# Altium schematic sheet SD.schdoc: TEBF0808 - SD
size A4; DocumentNumber: TEBF0808; Revision: 04; SheetNumber: 24; SheetTotal: 36; Date: 2016-09-29; CompanyName: Trenz Electronic GmbH; Organization: Trenz Electronic GmbH
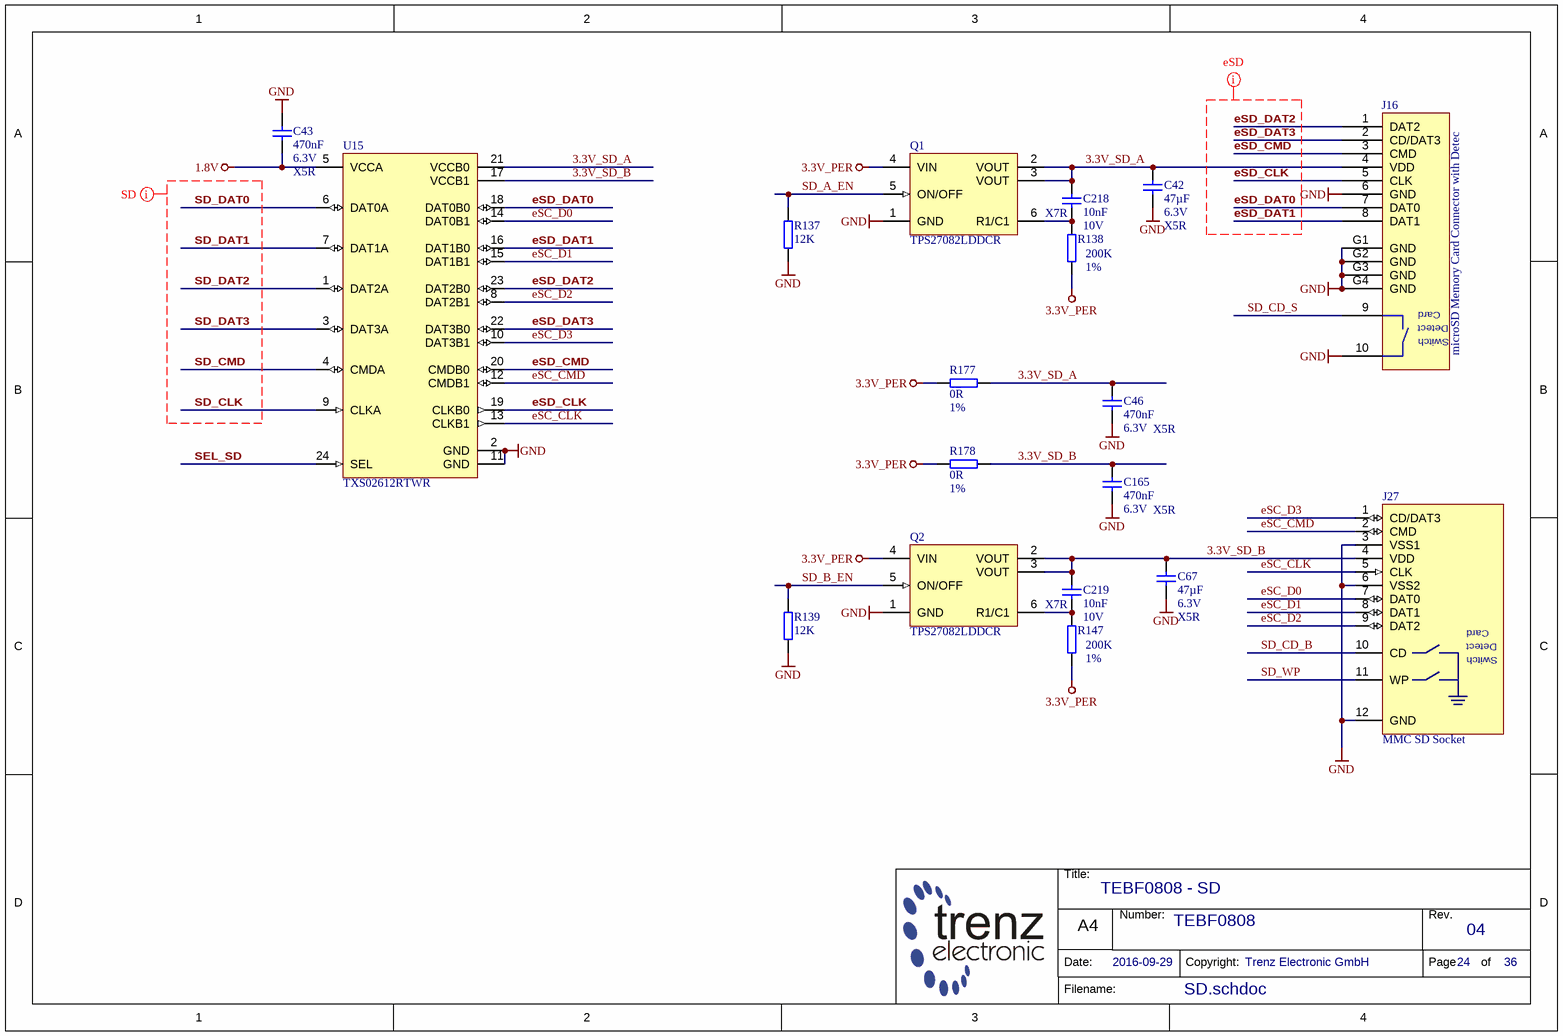
[diagram p0: SD.schdoc]

## Parts
C42  47µF  Voltage: 6.3V  Technology: X5R  [CAPC3216X180N]
C43  470nF  Voltage: 6.3V  Technology: X5R  [CAPC1005X55N]
C46  470nF  Voltage: 6.3V  Technology: X5R  [CAPC1005X55N]
C67  47µF  Voltage: 6.3V  Technology: X5R  [CAPC3216X180N]
C165  470nF  Voltage: 6.3V  Technology: X5R  [CAPC1005X55N]
C218  10nF  Voltage: 10V  Technology: X7R  [CAPC0603X33N]
C219  10nF  Voltage: 10V  Technology: X7R  [CAPC0603X33N]
J16  microSD Memory Card Connector with Detec  [104031-0811]
J27  MMC SD Socket  [104C-TAA0-R]
Q1  TPS27082LDDCR  [SOT95P280X110-6N]
Q2  TPS27082LDDCR  [SOT95P280X110-6N]
R137  12K  [RESC1005X40N]
R138  200K  Tolerance: 1%  [RESC1005X40N]
R139  12K  [RESC1005X40N]
R147  200K  Tolerance: 1%  [RESC1005X40N]
R177  0R  Tolerance: 1%  [RESC1005X40N]
R178  0R  Tolerance: 1%  [RESC1005X40N]
U15  TXS02612RTWR  [QFN50P400X400X80-25N-255]

## Nets
1.8V: C43.1 U15.5(VCCA)
3.3V_PER: Q1.4(VIN) Q2.4(VIN) R138.2 R147.2 R177.1 R178.1
GND: C42.2 C43.2 C46.1 C67.2 C165.1 J16.6(GND) J16.10(CDSW) J16.G1(GND) J16.G2(GND) J16.G3(GND) J16.G4(GND) J27.3(VSS1) J27.6(VSS2) J27.12(GND) Q1.1(GND) Q2.1(GND) R137.2 R139.2 U15.2(GND) U15.11(GND)
3.3V_SD_A: C42.1 C46.2 C218.1 J16.4(VDD) Q1.2(VOUT) Q1.3(VOUT) R177.2 U15.21(VCCB0)
3.3V_SD_B: C67.1 C165.2 C219.1 J27.4(VDD) Q2.2(VOUT) Q2.3(VOUT) R178.2 U15.17(VCCB1)
eSC_CLK: J27.5(CLK) U15.13(CLKB1)
eSC_CMD: J27.2(CMD) U15.12(CMDB1)
eSC_D0: J27.7(DAT0) U15.14(DAT0B1)
eSC_D1: J27.8(DAT1) U15.15(DAT1B1)
eSC_D2: J27.9(DAT2) U15.8(DAT2B1)
eSC_D3: J27.1(CD/DAT3) U15.10(DAT3B1)
eSD_CLK: J16.5(CLK) U15.19(CLKB0)
eSD_CMD: J16.3(CMD) U15.20(CMDB0)
eSD_DAT0: J16.7(DAT0) U15.18(DAT0B0)
eSD_DAT1: J16.8(DAT1) U15.16(DAT1B0)
eSD_DAT2: J16.1(DAT2) U15.23(DAT2B0)
eSD_DAT3: J16.2(CD/DAT3) U15.22(DAT3B0)
SD_A_EN: Q1.5(ON/OFF) R137.1
SD_B_EN: Q2.5(ON/OFF) R139.1
SD_CD_B: J27.10(CD)
SD_CD_S: J16.9(CDSW)
SD_CLK: U15.9(CLKA)
SD_CMD: U15.4(CMDA)
SD_DAT0: U15.6(DAT0A)
SD_DAT1: U15.7(DAT1A)
SD_DAT2: U15.1(DAT2A)
SD_DAT3: U15.3(DAT3A)
SD_WP: J27.11(WP)
SEL_SD: U15.24(SEL)
NetC218_2: C218.2 Q1.6(R1/C1) R138.1
NetC219_2: C219.2 Q2.6(R1/C1) R147.1

## Layout directives
net class eSD: eSD_CLK, eSD_CMD, eSD_DAT0, eSD_DAT1, eSD_DAT2, eSD_DAT3
net class SD: SD_CLK, SD_CMD, SD_DAT0, SD_DAT1, SD_DAT2, SD_DAT3

## Notes on the sheet
- Title:
- Number:
- Rev.
- Date:
- A4
- Copyright:
- Page
- of
- Filename:
- (in symbol 24818) Card; Detect; Switch
- (in symbol 26322) Card; Detect; Switch

## Library data of the parts
C42 C67 = 24557: KON 47µF 6.3V  X5R SMD 20%; AN: 24557; Value: 47u; Mixed: SMT; Preferred: Yes; Case: 3216 (1206); Tolerance: 20%
C43 C46 C165 = 23659: KON 470nF 6,3V X5R SMD; AN: 23659; Value: 470n; Mixed: SMT; Preferred: Yes; Case: 1005 (0402)
C218 C219 = 26312: KON 10nF X7R 10V SMD 10%; AN: 26312; Value: 10n; Mixed: SMT; Preferred: Yes; Case: 0603 (0201); Tolerance: 10%
J16 = 26322: microSD Memory Card Connector with Detect Switch; AN: 26322; Mixed: SMT; Trenz-Stock: Yes; Case: microSD; HelpURL: B:\AD\adlib\datasheet\104031-0811; H-ART: 104031-0811
J27 = 24818: MCC SD Socket; AN: 24818; Mixed: SMT; Trenz-Stock: Yes; H-ART: 693063010911; Case: MMC SD; HelpURL: B:\AD\adlib\datasheet\104C-TAA0-R
Q1 Q2 = 25004: AN: 25004; Trenz-Stock: Yes; Mixed: SMT; Case: SOT23-6; HelpURL: B:\AD\adlib\datasheet\TPS27082L; Preferred: Yes; H-ART: TPS27082LDDCR
R137 R139 = 22598: WID SMD 12K 1% 0,063W; AN: 22598; Mixed: SMT; Preferred: Yes; Tolerance: 1%; Case: 1005 (0402); Technology: TK100; Value: 12K
R138 R147 = 23846: WID SMD 200K 1% 0,063W; AN: 23846; Mixed: SMT; Preferred: Yes; Case: 1005 (0402); Value: 200K; Technology: TK100
R177 R178 = 22738: WID SMD 0R; AN: 22738; Mixed: SMT; Value: 0; Preferred: Yes; Case: 1005 (0402); Technology: TK100
U15 = 24904: AN: 24904; Trenz-Stock: Yes; Mixed: SMT; Case: QFN24; HelpURL: B:\AD\adlib\datasheet\TXS02612; H-ART: TXS02612RTWR